# Altium project Ethernut.PrjPcb
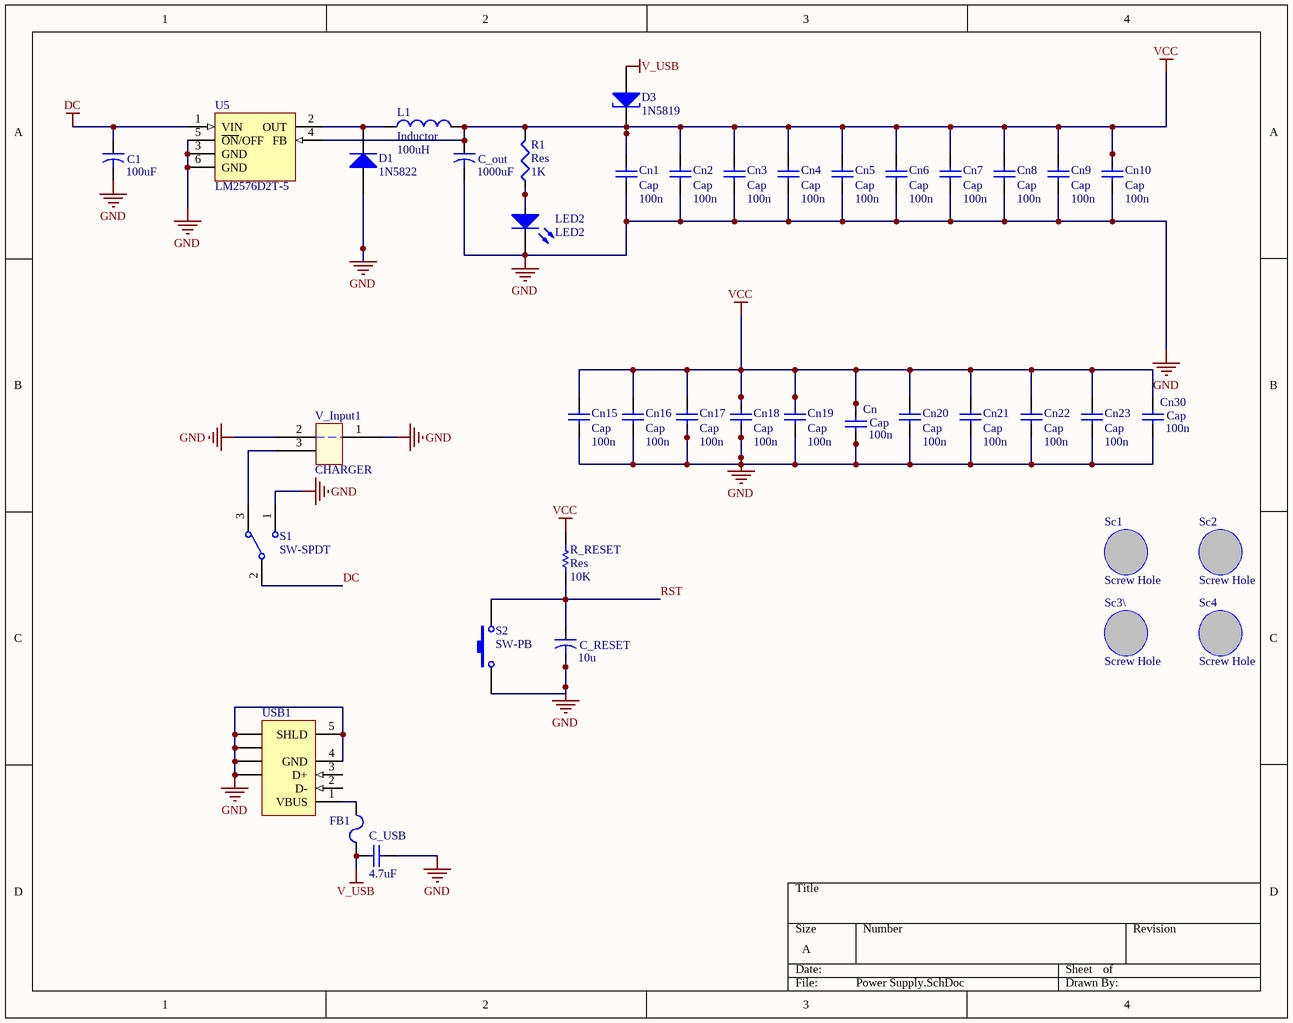
[diagram p0: Power Supply.SchDoc]
4 sheets, 98 parts. Net scope: global (net labels, ports and power ports of the same name join across sheets).
Board file: PCB1.PcbDoc
Sheets:
  Power Supply.SchDoc
  CPU.SchDoc
  Ethernet Interface.SchDoc
  SRAM & Expansion Port.SchDoc

## Sheet Power Supply.SchDoc
size A

### Parts
C1  value 100uF  [CA1.5P]  (hidden comment: Cap_El)
C_out  value 1000uF  [CA1.5P]  (hidden comment: Cap_El)
C_RESET  value 10u  [CA1.5P]  (hidden comment: Cap_El)
C_USB  value 4.7uF  [2012[0805]]  (hidden comment: Cap_UP)
Cn  Cap  value 100n  [1608[0603]]
Cn1  Cap  value 100n  [1608[0603]]
Cn2  Cap  value 100n  [1608[0603]]
Cn3  Cap  value 100n  [1608[0603]]
Cn4  Cap  value 100n  [1608[0603]]
Cn5  Cap  value 100n  [1608[0603]]
Cn6  Cap  value 100n  [1608[0603]]
Cn7  Cap  value 100n  [1608[0603]]
Cn8  Cap  value 100n  [1608[0603]]
Cn9  Cap  value 100n  [1608[0603]]
Cn10  Cap  value 100n  [1608[0603]]
Cn15  Cap  value 100n  [1608[0603]]
Cn16  Cap  value 100n  [1608[0603]]
Cn17  Cap  value 100n  [1608[0603]]
Cn18  Cap  value 100n  [1608[0603]]
Cn19  Cap  value 100n  [1608[0603]]
Cn20  Cap  value 100n  [1608[0603]]
Cn21  Cap  value 100n  [1608[0603]]
Cn22  Cap  value 100n  [1608[0603]]
Cn23  Cap  value 100n  [1608[0603]]
Cn30  Cap  value 100n  [1608[0603]]
D1  1N5822  [US1M]
D3  1N5819  [us1m]
FB1  (no value)  [2012[0805]]
L1  Inductor  value 100uH  [AXIAL-0.3]
LED2  LED2  [3518]
R1  Res  value 1K  [1608[0603]]
R_RESET  Res  value 10K  [1608[0603]]
S1  SW-SPDT  [SW-SPDT]
S2  SW-PB  [SPST-2]
Sc1  Screw Hole  [Screw Holw 3-6 mm]
Sc2  Screw Hole  [Screw Holw 3-6 mm]
Sc3\  Screw Hole  [Screw Holw 3-6 mm]
Sc4  Screw Hole  [Screw Holw 3-6 mm]
U5  LM2576D2T-5  [936A-02]
USB1  (no value)  [USB_Mini]
V_Input1  CHARGER  [CHARGER]

### Nets
DC: C1.1 S1.2 U5.1(VIN)
GND: C1.2 C_out.2 C_RESET.2 C_USB.2 Cn.2 Cn1.1 Cn2.1 Cn3.1 Cn4.1 Cn5.1 Cn6.1 Cn7.1 Cn8.1 Cn9.1 Cn10.1 Cn15.1 Cn16.1 Cn17.1 Cn18.1 Cn19.1 Cn20.1 Cn21.1 Cn22.1 Cn23.1 Cn30.2 D1.1(A) LED2.2(K) S1.1 S2.1 U5.3(GND) U5.5(~{ON}/OFF) U5.6(GND) USB1.4(GND) USB1.5(SHLD) USB1.6(SHLD) USB1.7(SHLD) USB1.8(SHLD) USB1.9(SHLD) V_Input1.1 V_Input1.2  [project net P8]
V_USB: C_USB.1 D3.2(A) FB1.2
VCC: C_out.1 Cn.1 Cn1.2 Cn2.2 Cn3.2 Cn4.2 Cn5.2 Cn6.2 Cn7.2 Cn8.2 Cn9.2 Cn10.2 Cn15.2 Cn16.2 Cn17.2 Cn18.2 Cn19.2 Cn20.2 Cn21.2 Cn22.2 Cn23.2 Cn30.1 D3.1(K) L1.2 R1.2 R_RESET.1 U5.4(FB)
RST: C_RESET.1 R_RESET.2 S2.2
NetD1_2: D1.2(K) L1.1 U5.2(OUT)
NetFB1_1: FB1.1 USB1.1(VBUS)
NetLED2_1: LED2.1(A) R1.1
NetS1_3: S1.3 V_Input1.3

Not connected (* = marked no-connect by the designer): USB1 2(D-) 3(D+)

### Library data of the parts
C1 C_out C_RESET = Cap_El: Capacitor; Published: 23-Sep-2002; PackageReference: CAPR5-4X5; Publisher: Altium Limited
C_USB Cn Cn30 = Cap_UP: Capacitor; Published: 8-Jun-2000; LatestRevisionDate: 17-Jul-2002; LatestRevisionNote: Re-released for DXP Platform.; PackageReference: RAD-0.3; Publisher: Altium Limited
Cn1-Cn10 Cn15-Cn23 = Cap: Capacitor; Published: 8-Jun-2000; LatestRevisionDate: 17-Jul-2002; LatestRevisionNote: Re-released for DXP Platform.; PackageReference: RAD-0.3; Publisher: Altium Limited; PackageDescription: Radial Cap, Thru-Hole; 2 Leads; 0.3 in Pin Spacing
D1 = Diode: 1 Amp General Purpose Rectifier; Revision 1: 11-Jul-2000: SIM Model Added.; Revision 2: 17-Jul-2002: Re-released for DXP Platform.; Package Information: Latest Revision: Aug-1999; Code - JEDEC: DO-204-AL; Published: 8-Jun-2000; Datasheet: Latest Revision: 1998; Package Reference: DO-41; Publisher: Altium Limited
D3 = Diode_ShotKey: 1 Amp General Purpose Rectifier; Revision 1: 11-Jul-2000: SIM Model Added.; Revision 2: 17-Jul-2002: Re-released for DXP Platform.; Package Information: Latest Revision: Aug-1999; Code - JEDEC: DO-204-AL; Published: 8-Jun-2000; Datasheet: Latest Revision: 1998; Package Reference: DO-41; Publisher: Altium Limited
FB1 = Ferrite Beed: Code_IEC: 1005; Published: 8-Jun-2000; LatestRevisionDate: 17-Jul-2002; LatestRevisionNote: Re-released for DXP Platform.; PackageReference: 0402-A; Publisher: Altium Limited; Code_JEITA: 0402
L1 = Inductor: Code_IEC: 1005; Published: 8-Jun-2000; LatestRevisionDate: 29-May-2009; LatestRevisionNote: IPC-7351 Footprint Added.; PackageReference: 0402-A; Publisher: Altium Limited; PackageDescription: Chip Inductor; Code_JEITA: 0402
LED2 = LED2: Typical RED, GREEN, YELLOW, AMBER GaAs LED; Published: 8-Jun-2000; LatestRevisionDate: 17-Jul-2002; LatestRevisionNote: Re-released for DXP Platform.; PackageVersion: Feb-2002; PackageReference: 3.2X1.6X1.1; Publisher: Altium Limited; PackageDescription: SM LED; 2 Flat Leads
R1 = Res3: Resistor; Published: 8-Jun-2000; LatestRevisionDate: 29-May-2009; LatestRevisionNote: IPC-7351 Footprint Added.; PackageReference: J1-0603; Publisher: Altium Limited; PackageDescription: Chip Resistor
R_RESET = Res: Semiconductor Resistor; Published: 8-Jun-2000; LatestRevisionDate: 17-Jul-2002; LatestRevisionNote: Re-released for DXP Platform.; PackageReference: AXIAL-0.5; Publisher: Altium Limited
S1 = SW-SPDT: SPDT Subminiature Toggle Switch, Right Angle Mounting, Vertical Actuation; Published: 24-Mar-1999; LatestRevisionDate: 17-Dec-2003; LatestRevisionNote: Schematic revised, PCB Footprint replaced.; DatasheetVersion: 05-Dec-2000; PackageReference: TL36WW15050; Publisher: Altium Limited; PackageDescription: Switch; 4 Leads; ComponentLink1Description: Manufacturer Link; ComponentLink1URL: http://www.apem.com
S2 = SW-PB: Switch; Published: 24-Mar-1999; LatestRevisionDate: 17-Jul-2002; LatestRevisionNote: Re-released for DXP Platform.; PackageReference: SPST-2; Publisher: Altium Limited; PackageDescription: Switch; 2 Leads
U5 = LM2576D2T-5: Easy Switcher 3.0A Step-Down Voltage Regulator; Note: Pin 3 is electrically connected to Pin 6;Pin 6 is heatsink; Published: 15-Apr-2002; DatasheetVersion: Jul-1999; PackageVersion: Jul-1999; PackageReference: 936A-02; Publisher: Altium Limited; PackageDescription: D2-PAK; 5 Leads; Body 14.7 (inc. leads) x 10.2 mm (LxW max); ComponentLink1Description: Manufacturer Link; ComponentLink1URL: http://www.onsemi.com/site/products/taxonomy/0,4438,503,00.html; ComponentLink2Description: Datasheet; ComponentLink2URL: http://www.onsemi.com/pub/Collateral/LM2576-D.PDF
USB1 = 440479-1: USB 2.0, Right Angle, SMT, AB Type, Receptacle, 5 Position, Black; ContactMaterial: Phosphor Bronze; ContactPlating: Gold (30) over Nickel; PCB_Layout: Complies with manufacturer's recommendation.; DrillSize: Corresponds to nominal value.; PanelGround: Without; Published: 15-Jul-2004; DatasheetDocument: 28-Jan-2003; PackageDocument: 28-Jan-2003; PackageReference: 440479; Publisher: Altium Limited; HousingMaterial: Thermoplastic; ComponentLink1Description: Manufacturer Link; ComponentLink1URL: http://www.tycoelectronics.com/; ComponentLink2Description: Packaging Specification; ComponentLink2URL: http://ecommas.tycoelectronics.com/commerce/DocumentDelivery/DDEController?Action=showdoc&DocId=Customer+Drawing%7F440479%7FD%7Fpdf%7FEnglish%7FC_440479_D.pdf

## Sheet CPU.SchDoc
size A
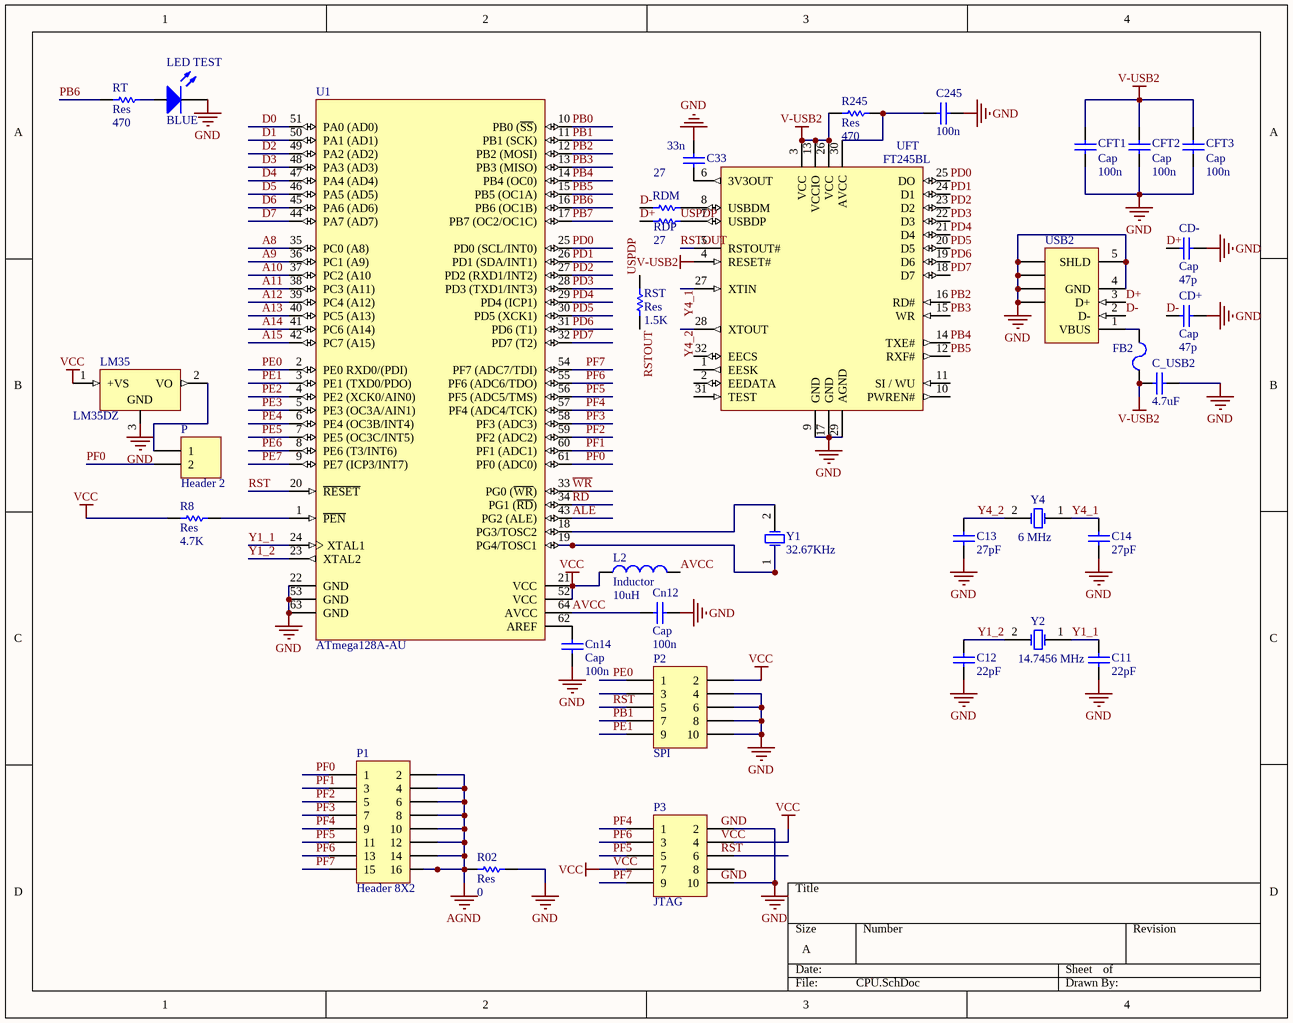
[diagram p1: CPU.SchDoc]

### Parts
C11  value 22pF  [1608[0603]]  (hidden comment: Cap_UP)
C12  value 22pF  [1608[0603]]  (hidden comment: Cap_UP)
C13  value 27pF  [1608[0603]]  (hidden comment: Cap_UP)
C14  value 27pF  [1608[0603]]  (hidden comment: Cap_UP)
C33  value 33n  [1608[0603]]  (hidden comment: Cap_UP)
C245  value 100n  [1608[0603]]  (hidden comment: Cap_UP)
C_USB2  value 4.7uF  [2012[0805]]  (hidden comment: Cap_UP)
CD+  Cap  value 47p  [1608[0603]]
CD-  Cap  value 47p  [1608[0603]]
CFT1  Cap  value 100n  [1608[0603]]
CFT2  Cap  value 100n  [1608[0603]]
CFT3  Cap  value 100n  [1608[0603]]
Cn12  Cap  value 100n  [1608[0603]]
Cn14  Cap  value 100n  [1608[0603]]
FB2  (no value)  [2012[0805]]
L2  Inductor  value 10uH  [2012[0805]]
LED_TEST  BLUE  [3518]
LM35  LM35DZ  [Z03A]
P  Header 2  [HDR1X2]
P1  Header 8X2  [HDR2X8]
P2  SPI  [HDR2X5]
P3  JTAG  [HDR2X5]
R02  Res  value 0  [1608[0603]]
R8  Res  value 4.7K  [1608[0603]]
R245  Res  value 470  [1608[0603]]
RDM  value 27  [1608[0603]]  (hidden comment: Res)
RDP  value 27  [1608[0603]]  (hidden comment: es)
RST  Res  value 1.5K  [1608[0603]]
RT  Res  value 470  [1608[0603]]
U1  ATmega128A-AU  [64A_N]
UFT  FT245BL  [LQFP-32_N]
USB2  (no value)  [USB_Mini]
Y1  32.67KHz  [Xtal-smd]
Y2  14.7456 MHz  [Xtal-smd]
Y4  6 MHz  [Xtal-smd]

### Nets
AGND: P1.2 P1.4 P1.6 P1.8 P1.10 P1.12 P1.14 P1.16 R02.2
GND: C11.2 C12.2 C13.2 C14.2 C33.2 C245.2 C_USB2.2 CD+.1 CD-.1 CFT1.1 CFT2.1 CFT3.1 Cn12.1 Cn14.2 LED_TEST.2(K) P2.4 P2.6 P2.8 P2.10 P3.2 P3.10 R02.1 U1.22(GND) U1.53(GND) U1.63(GND) UFT.9(GND) UFT.17(GND) UFT.29(AGND) USB2.4(GND) USB2.5(SHLD) USB2.6(SHLD) USB2.7(SHLD) USB2.8(SHLD) USB2.9(SHLD)  [project net P8]
V-USB2: C_USB2.1 CFT1.2 CFT2.2 CFT3.2 FB2.2 R245.1 UFT.3(VCC) UFT.4(RESET#) UFT.13(VCCIO) UFT.26(VCC)
VCC: L2.1 LM35.1(+VS) P2.2 P3.4 P3.7 R8.1 U1.21(VCC) U1.52(VCC)
A8: U1.35(PC0_(A8))
A9: U1.36(PC1_(A9))
A10: U1.37(PC2_(A10)
A11: U1.38(PC3_(A11))
A12: U1.39(PC4_(A12))
A13: U1.40(PC5_(A13))
A14: U1.41(PC6_(A14))
A15: U1.42(PC7_(A15))
ALE: U1.43(PG2_(ALE))
AVCC: Cn12.2 L2.2 U1.64(AVCC)
D0: U1.51(PA0_(AD0))
D1: U1.50(PA1_(AD1))
D2: U1.49(PA2_(AD2))
D3: U1.48(PA3_(AD3))
D4: U1.47(PA4_(AD4))
D5: U1.46(PA5_(AD5))
D6: U1.45(PA6_(AD6))
D7: U1.44(PA7_(AD7))
D+: CD-.2 RDP.1 USB2.3(D+)
D-: CD+.2 RDM.1 USB2.2(D-)
PB0: U1.10(PB0_(~{SS}))
PB1: P2.7 U1.11(PB1_(SCK))
PB2: U1.12(PB2_(MOSI)) UFT.16(RD#)
PB3: U1.13(PB3_(MISO)) UFT.15(WR)
PB4: U1.14(PB4_(OC0)) UFT.14(TXE#)
PB5: U1.15(PB5_(OC1A)) UFT.12(RXF#)
PB6: RT.2 U1.16(PB6_(OC1B))
PB7: U1.17(PB7_(OC2/OC1C))
PD0: U1.25(PD0_(SCL/INT0)) UFT.25(DO)
PD1: U1.26(PD1_(SDA/INT1)) UFT.24(D1)
PD2: U1.27(PD2_(RXD1/INT2)) UFT.23(D2)
PD3: U1.28(PD3_(TXD1/INT3)) UFT.22(D3)
PD4: U1.29(PD4_(ICP1)) UFT.21(D4)
PD5: U1.30(PD5_(XCK1)) UFT.20(D5)
PD6: U1.31(PD6_(T1)) UFT.19(D6)
PD7: U1.32(PD7_(T2)) UFT.18(D7)
PE0: P2.1 U1.2(PE0_RXD0/(PDI))
PE1: P2.9 U1.3(PE1_(TXD0/PDO))
PE2: U1.4(PE2_(XCK0/AIN0))
PE3: U1.5(PE3_(OC3A/AIN1))
PE4: U1.6(PE4_(OC3B/INT4))
PE5: U1.7(PE5_(OC3C/INT5))
PE6: U1.8(PE6_(T3/INT6))
PE7: U1.9(PE7_(ICP3/INT7))
PF0: P.2 P1.1 U1.61(PF0_(ADC0))
PF1: P1.3 U1.60(PF1_(ADC1))
PF2: P1.5 U1.59(PF2_(ADC2))
PF3: P1.7 U1.58(PF3_(ADC3))
PF4: P1.9 P3.1 U1.57(PF4_(ADC4/TCK))
PF5: P1.11 P3.5 U1.56(PF5_(ADC5/TMS))
PF6: P1.13 P3.3 U1.55(PF6_(ADC6/TDO))
PF7: P1.15 P3.9 U1.54(PF7_(ADC7/TDI))
~{RD}: U1.34(PG1_(~{RD}))
RST: P2.5 U1.20(~{RESET})
RSTOUT: RST.1 UFT.5(RSTOUT#)
USPDP: RST.2
~{WR}: U1.33(PG0_(~{WR}))
Y1_1: C11.1 U1.24(XTAL1) Y2.1(OSC1)
Y1_2: C12.1 U1.23(XTAL2) Y2.2(OSC2)
Y4_1: C14.1 UFT.27(XTIN) Y4.1(OSC1)
Y4_2: C13.1 UFT.28(XTOUT) Y4.2(OSC2)
NetC33_1: C33.1 UFT.6(3V3OUT)
NetC245_1: C245.1 R245.2 UFT.30(AVCC)
NetCn14_1: Cn14.1 U1.62(AREF)
NetFB2_1: FB2.1 USB2.1(VBUS)
NetLED_TEST_1: LED_TEST.1(A) RT.1
NetLM35_2: LM35.2(VO) P.1
NetR8_2: R8.2 U1.1(~{PEN})
NetRDM_2: RDM.2 UFT.8(USBDM)
NetRDP_2: RDP.2 UFT.7(USBDP)
NetU1_18: U1.18(PG3/TOSC2) Y1.2(OSC2)
NetU1_19: U1.19(PG4/TOSC1) Y1.1(OSC1)

Not connected (* = marked no-connect by the designer): LM35 3(GND); P2 3; P3 6 8; UFT 1(EESK) 2(EEDATA) 10(PWREN#) 11(SI_/_WU) 31(TEST) 32(EECS)

### Notes on the sheet
- Labels drawn without touching a wire or pin: GND, RST, USPDP, VCC

### Library data of the parts
C11-C14 C33 C245 C_USB2 = Cap_UP: Capacitor; Published: 8-Jun-2000; LatestRevisionDate: 17-Jul-2002; LatestRevisionNote: Re-released for DXP Platform.; PackageReference: RAD-0.3; Publisher: Altium Limited
CD+ CD- CFT1-CFT3 Cn12 Cn14 = Cap: Capacitor; Published: 8-Jun-2000; LatestRevisionDate: 17-Jul-2002; LatestRevisionNote: Re-released for DXP Platform.; PackageReference: RAD-0.3; Publisher: Altium Limited; PackageDescription: Radial Cap, Thru-Hole; 2 Leads; 0.3 in Pin Spacing
FB2 = Ferrite Beed: Code_IEC: 1005; Published: 8-Jun-2000; LatestRevisionDate: 17-Jul-2002; LatestRevisionNote: Re-released for DXP Platform.; PackageReference: 0402-A; Publisher: Altium Limited; Code_JEITA: 0402
L2 = Inductor: Code_IEC: 1005; Published: 8-Jun-2000; LatestRevisionDate: 29-May-2009; LatestRevisionNote: IPC-7351 Footprint Added.; PackageReference: 0402-A; Publisher: Altium Limited; PackageDescription: Chip Inductor; Code_JEITA: 0402
LED_TEST = LED3: Typical BLUE SiC LED; Published: 8-Jun-2000; LatestRevisionDate: 17-Dec-2003; LatestRevisionNote: PCB Footprint replaced.; DatasheetVersion: 16-Apr-2002; PackageVersion: 16-Apr-2002; PackageReference: 3.5X2.8X1.9; Publisher: Altium Limited; PackageDescription: SM LED; 2 C-Bend Leads; Body 3.5 x 2.8 x 1.9 mm, inc leads (LxWxH typ)
LM35 = LM35DZ: Precision Centigrade Temperature Sensor, 3-pin TO-92; Manufacturer: National Semiconductor; PackageTopMarking: NSXYTT*LM35*DZ; PowerWise: N; CompType: Temp Sensor IC; High-Reliability: Y; DatasheetVersion: Nov-2000; PackageVersion: revG, Sep-2000; PackageReference: Z03A; PackageDescription: TO-92, Molded, 3 Lead; PartNumber: LM35DZ; RoHS: N; PinCount: 3; Code_JEDEC: TO-226-AA; ComponentLink1Description: Manufacturer URL; ComponentLink1URL: http://www.national.com/; ComponentLink2Description: LM35 Datasheet; ComponentLink2URL: http://www.national.com/ds/LM/LM35.pdf; ComponentLink3Description: LM35 Web Page; ComponentLink3URL: http://www.national.com/pf/LM/LM35.html; ComponentLink4Description: Z03A Package Page; ComponentLink4URL: http://www.national.com/packaging/folders/z03a.html
P = Header 2: Header, 2-Pin; LatestRevisionDate: 17-Jul-2002; LatestRevisionNote: Re-released for DXP Platform.; Publisher: Altium Limited
P1 = Header 8X2: Header, 8-Pin, Dual row; LatestRevisionDate: 17-Jul-2002; LatestRevisionNote: Re-released for DXP Platform.; Publisher: Altium Limited
P2 P3 = Header 5X2: Header, 5-Pin, Dual row; LatestRevisionDate: 17-Jul-2002; LatestRevisionNote: Re-released for DXP Platform.; Publisher: Altium Limited
R02 R8 R245 RDM RDP RST RT = Res: Semiconductor Resistor; Published: 8-Jun-2000; LatestRevisionDate: 17-Jul-2002; LatestRevisionNote: Re-released for DXP Platform.; PackageReference: AXIAL-0.5; Publisher: Altium Limited
U1 = ATmega128A-AU: 8-bit AVR Microcontroller, 2.7-5.5V, 16MHz, 128KB Flash, 4KB EEPROM, 4KB SRAM, 64-pin TQFP, Industrial Grade (-40°C to 85°C); DatasheetVersion: revH, Feb-2011; PackageVersion: revC, Oct-2010; PackageReference: 64A; PackageDescription: 64-Pin Plastic Thin Profile Quad Flat Pack, 14 x 14 x 1.0 mm Body, 0.8 mm Pitch (TQFP); Code_JEDEC: MS-026-AEB; ComponentLink1Description: Manufacturer URL; ComponentLink1URL: http://www.atmel.com/; ComponentLink2Description: ATmega128A Datasheet; ComponentLink2URL: http://www.atmel.com/dyn/resources/prod_documents/doc8151.pdf; ComponentLink3Description: ATmega128A Summary; ComponentLink3URL: http://www.atmel.com/dyn/resources/prod_documents/8151S.pdf
UFT = FT245BL: USB/Parallel FIFO Bi-Directional Data Transfer Chip, LQFP-32, Pb-Free; Published: 6-Jun-2005; LatestRevisionDate: 13-Apr-2006; LatestRevisionNote: IPC-7351 Footprint Added.; DatasheetVersion: ver 1.7, Dec-2005; PackageVersion: 2004; PackageReference: LQFP-32; Publisher: Altium Limited; PackageDescription: 32-Pin Thin Quad Flat Pack 0.8 mm Pitch; ComponentLink1Description: Manufacturer Link; ComponentLink1URL: http://www.ftdichip.com/Products/ICs/FT245B.htm; ComponentLink2Description: Datasheet; ComponentLink2URL: http://www.ftdichip.com/Support/Documents/DataSheets/ICs/DS_FT245BL.pdf
USB2 = 440479-1: as USB1 on sheet Power Supply; Published: 15-Jul-2004; DatasheetDocument: 28-Jan-2003; PackageDocument: 28-Jan-2003; PackageReference: 440479; Publisher: Altium Limited; HousingMaterial: Thermoplastic; ComponentLink1Description: Manufacturer Link; ComponentLink1URL: http://www.tycoelectronics.com/; ComponentLink2Description: Packaging Specification; ComponentLink2URL: http://ecommas.tycoelectronics.com/commerce/DocumentDelivery/DDEController?Action=showdoc&DocId=Customer+Drawing%7F440479%7FD%7Fpdf%7FEnglish%7FC_440479_D.pdf
Y1 Y2 Y4 = XTAL: Crystal Oscillator; Published: 8-Jun-2000; LatestRevisionDate: 17-Jul-2002; LatestRevisionNote: Re-released for DXP Platform.; PackageReference: R38; Publisher: Altium Limited

## Sheet Ethernet Interface.SchDoc
size A
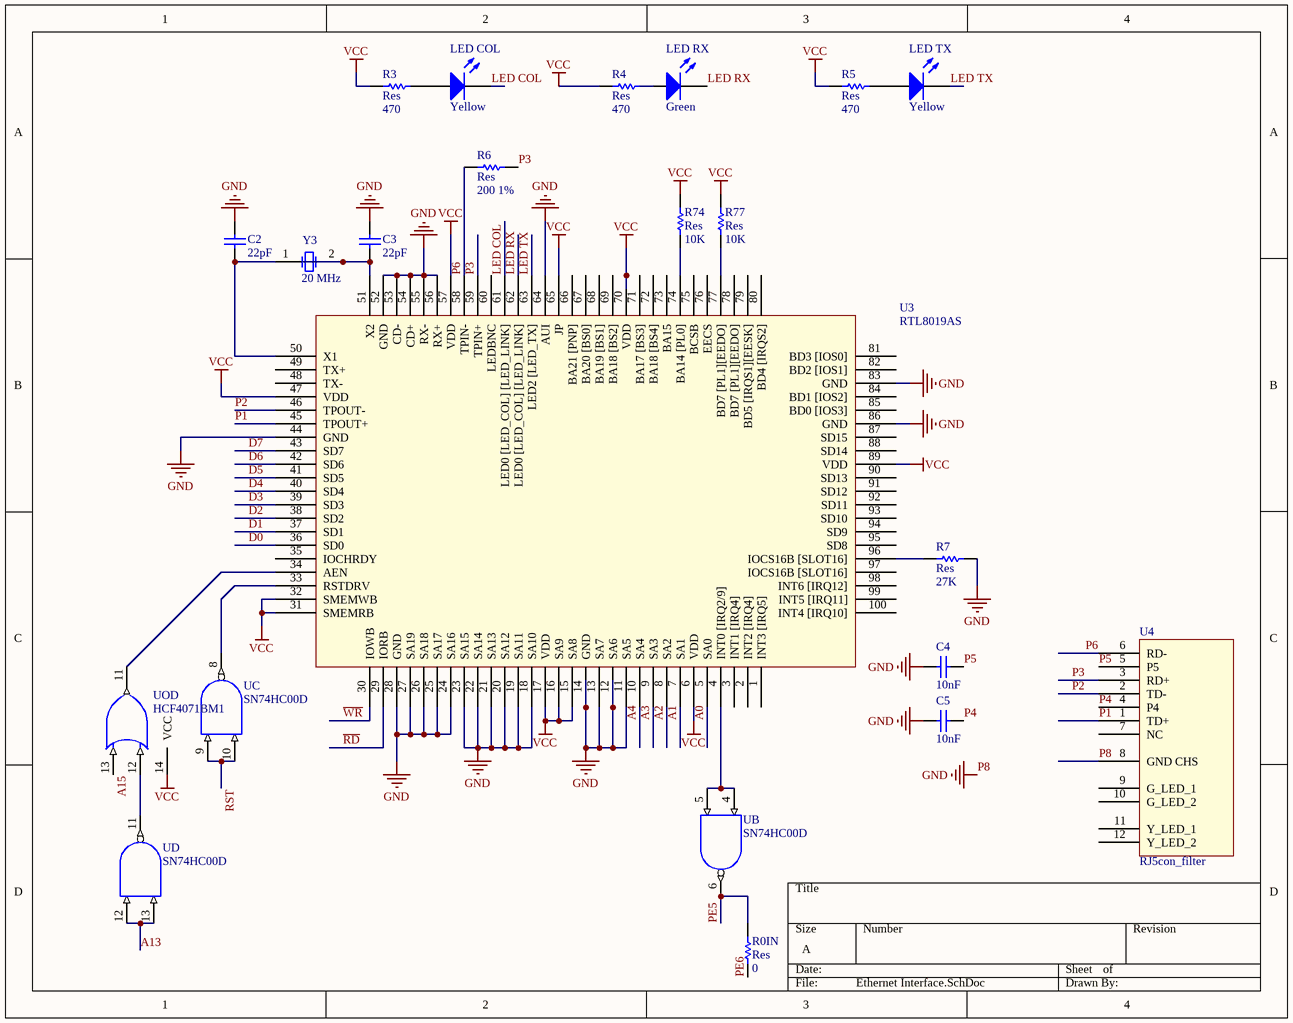
[diagram p2: Ethernet Interface.SchDoc]

### Parts
C2  value 22pF  [1608[0603]]  (hidden comment: Cap_UP)
C3  value 22pF  [1608[0603]]  (hidden comment: Cap_UP)
C4  value 10nF  [1608[0603]]  (hidden comment: Cap_UP)
C5  value 10nF  [1608[0603]]  (hidden comment: Cap_UP)
LED_COL  Yellow  [3518]
LED_RX  Green  [3518]
LED_TX  Yellow  [3518]
R0IN  Res  value 0  [1608[0603]]
R3  Res  value 470  [1608[0603]]
R4  Res  value 470  [1608[0603]]
R5  Res  value 470  [1608[0603]]
R6  Res  value 200 1%  [1608[0603]]
R7  Res  value 27K  [1608[0603]]
R74  Res  value 10K  [1608[0603]]
R77  Res  value 10K  [1608[0603]]
U  SN74HC00D  [D014_N]  (parts B,C,D of 4)
U3  RTL8019AS  [RTL8019AS]
U4  RJ5con_filter  [RJ45con_Filter]
UO  HCF4071BM1  [SO14_N]  (part D of 4)
Y3  20 MHz  [Xtal-smd]

### Nets
P8: C2.2 C3.2 C4.1 C5.1 R7.1 U.7(GND) U3.11(SA5) U3.12(SA6) U3.13(SA7) U3.14(GND) U3.18(SA10) U3.19(SA11) U3.20(SA12) U3.21(SA13) U3.22(SA14) U3.23(SA15) U3.24(SA16) U3.25(SA17) U3.26(SA18) U3.27(SA19) U3.28(GND) U3.44(GND) U3.52(GND) U3.53(CD-) U3.54(CD+) U3.55(RX-) U3.56(RX+) U3.64(AUI) U3.83(GND) U3.86(GND) U4.8(GND_CHS) UO.7(GND)  [also labelled GND]
VCC: R3.2 R4.2 R5.2 R74.1 R77.1 U.14(VCC) U3.6(VDD) U3.15(SA8) U3.16(SA9) U3.17(VDD) U3.31(SMEMRB) U3.32(SMEMWB) U3.47(VDD) U3.57(VDD) U3.65(JP) U3.70(VDD) U3.89(VDD) UO.14(VCC)
A0: U3.5(SA0)
A1: U3.7(SA1)
A2: U3.8(SA2)
A3: U3.9(SA3)
A4: U3.10(SA4)
A13: U.12(A) U.13(B)
A15: UO.13(G)
D0: U3.36(SD0)
D1: U3.37(SD1)
D2: U3.38(SD2)
D3: U3.39(SD3)
D4: U3.40(SD4)
D5: U3.41(SD5)
D6: U3.42(SD6)
D7: U3.43(SD7)
LED COL: LED_COL.2(K) U3.61(LED0_[LED_COL]_[LED_LINK])
LED RX: LED_RX.2(K) U3.62(LED0_[LED_COL]_[LED_LINK])
LED TX: LED_TX.2(K) U3.63(LED2_[LED_TX])
P1: U3.45(TPOUT+) U4.1(TD+)
P2: U3.46(TPOUT-) U4.2(TD-)
P3: R6.2 U3.59(TPIN+) U4.3(RD+)
P4: C5.2 U4.4(P4)
P5: C4.2 U4.5(P5)
P6: R6.1 U3.58(TPIN-) U4.6(RD-)
PE5: R0IN.1 U.6(Y)
PE6: R0IN.2
~{RD}: U3.29(IORB)
RST: U.9(A) U.10(B)
~{WR}: U3.30(IOWB)
NetC2_1: C2.1 U3.50(X1) Y3.1(OSC1)
NetC3_1: C3.1 U3.51(X2) Y3.2(OSC2)
NetLED_COL_1: LED_COL.1(A) R3.1
NetLED_RX_1: LED_RX.1(A) R4.1
NetLED_TX_1: LED_TX.1(A) R5.1
NetR7_2: R7.2 U3.96(IOCS16B_[SLOT16])
NetR74_2: R74.2 U3.74(BA14_[PL0])
NetR77_2: R77.2 U3.77(BD7_[PL1][EEDO])
NetU3_34: U3.34(AEN) UO.11(M)
NetU_4: U.4(A) U.5(B) U3.4(INT0_[IRQ2/9])
NetU_8: U.8(Y) U3.33(RSTDRV)
NetU_11: U.11(Y) UO.12(H)

Not connected (* = marked no-connect by the designer): U3 1(INT3_[IRQ5]) 2(INT2_[IRQ4]) 3(INT1_[IRQ4]) 35(IOCHRDY) 48(TX-) 49(TX+) 60(LEDBNC) 66(BA21_[PNP]) 67(BA20_[BS0]) 68(BA19_[BS1]) 69(BA18_[BS2]) 71(BA17_[BS3]) 72(BA18_[BS4]) 73(BA15) 75(BCSB) 76(EECS) 78(BD7_[PL1][EEDO]) 79(BD5_[IRQS1][EESK]) 80(BD4_[IRQS2]) 81(BD3_[IOS0]) 82(BD2_[IOS1]) 84(BD1_[IOS2]) 85(BD0_[IOS3]) 87(SD15) 88(SD14) 90(SD13) 91(SD12) 92(SD11) 93(SD10) 94(SD9) 95(SD8) 97(IOCS16B_[SLOT16]) 98(INT6_[IRQ12]) 99(INT5_[IRQ11]) 100(INT4_[IRQ10]); U4 7(NC) 9(G_LED_1) 10(G_LED_2) 11(Y_LED_1) 12(Y_LED_2)

### Library data of the parts
C2-C5 = Cap_UP: Capacitor; Published: 8-Jun-2000; LatestRevisionDate: 17-Jul-2002; LatestRevisionNote: Re-released for DXP Platform.; PackageReference: RAD-0.3; Publisher: Altium Limited
LED_COL LED_RX LED_TX = LED3: Typical BLUE SiC LED; Published: 8-Jun-2000; LatestRevisionDate: 17-Dec-2003; LatestRevisionNote: PCB Footprint replaced.; DatasheetVersion: 16-Apr-2002; PackageVersion: 16-Apr-2002; PackageReference: 3.5X2.8X1.9; Publisher: Altium Limited; PackageDescription: SM LED; 2 C-Bend Leads; Body 3.5 x 2.8 x 1.9 mm, inc leads (LxWxH typ)
R0IN R3-R7 R74 R77 = Res: Semiconductor Resistor; Published: 8-Jun-2000; LatestRevisionDate: 17-Jul-2002; LatestRevisionNote: Re-released for DXP Platform.; PackageReference: AXIAL-0.5; Publisher: Altium Limited
U = SN74HC00D: Quadruple 2-Input Positive-NAND Gate; Published: 8-Jun-2000; LatestRevisionDate: 13-Apr-2006; LatestRevisionNote: IPC-7351 Footprint Added.; DatasheetVersion: May-1997; PackageVersion: Jan-1998; PackageReference: D014; Publisher: Altium Limited; PackageDescription: 14-Pin Small Outline Integrated Circuit 1.27 mm Pitch; Code_IPC: SOIC127P600-14; ComponentLink1Description: Manufacturer Link; ComponentLink1URL: http://www.ti.com/; ComponentLink2Description: Datasheet; ComponentLink2URL: http://www-s.ti.com/sc/ds/sn74hc00.pdf
U3 = RTL8019_as
U4 = HR911105A
UO = HCF4071BM1: Quad 2-Input OR Gate; Published: 8-Jun-2000; LatestRevisionDate: 13-Apr-2006; LatestRevisionNote: IPC-7351 Footprint Added.; DatasheetVersion: Jun-1989; PackageVersion: Sep-1998; PackageReference: SO14; Publisher: Altium Limited; PackageDescription: 14-Pin Small Outline Integrated Circuit 1.27 mm Pitch; Code_IPC: SOIC127P600-14; ComponentLink1Description: Manufacturer Link; ComponentLink1URL: http://www.st.com/; ComponentLink2Description: Datasheet; ComponentLink2URL: http://www.st.com/stonline/products/literature/ds/2062/hcf4071.pdf
Y3 = XTAL: Crystal Oscillator; Published: 8-Jun-2000; LatestRevisionDate: 17-Jul-2002; LatestRevisionNote: Re-released for DXP Platform.; PackageReference: R38; Publisher: Altium Limited

## Sheet SRAM & Expansion Port.SchDoc
size A
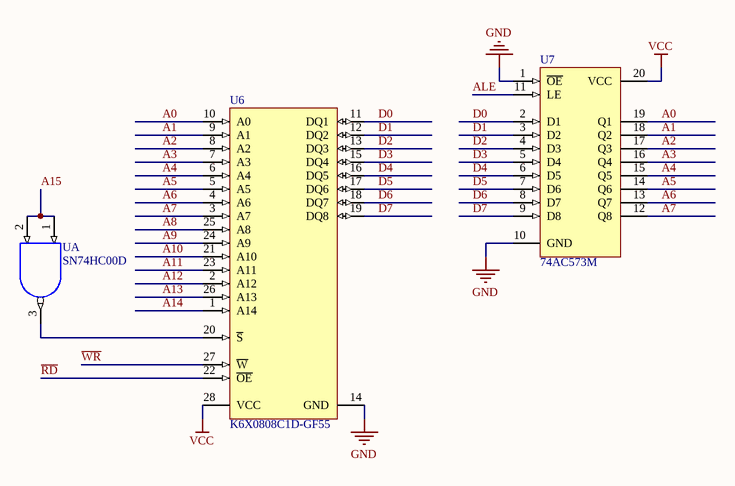
[diagram p3: SRAM & Expansion Port.SchDoc]

### Parts
U  SN74HC00D  [D014_N]  (part A of 4)
U6  K6X0808C1D-GF55  [PRSP0028DB-B_N]
U7  74AC573M  [SO20_N]

### Nets
GND: U.7(GND) U6.14(GND) U7.1(~{OE}) U7.10(GND)  [project net P8]
VCC: U.14(VCC) U6.28(VCC) U7.20(VCC)
A0: U6.10(A0) U7.19(Q1)
A1: U6.9(A1) U7.18(Q2)
A2: U6.8(A2) U7.17(Q3)
A3: U6.7(A3) U7.16(Q4)
A4: U6.6(A4) U7.15(Q5)
A5: U6.5(A5) U7.14(Q6)
A6: U6.4(A6) U7.13(Q7)
A7: U6.3(A7) U7.12(Q8)
A8: U6.25(A8)
A9: U6.24(A9)
A10: U6.21(A10)
A11: U6.23(A11)
A12: U6.2(A12)
A13: U6.26(A13)
A14: U6.1(A14)
A15: U.1(A) U.2(B)
ALE: U7.11(LE)
D0: U6.11(DQ1) U7.2(D1)
D1: U6.12(DQ2) U7.3(D2)
D2: U6.13(DQ3) U7.4(D3)
D3: U6.15(DQ4) U7.5(D4)
D4: U6.16(DQ5) U7.6(D5)
D5: U6.17(DQ6) U7.7(D6)
D6: U6.18(DQ7) U7.8(D7)
D7: U6.19(DQ8) U7.9(D8)
~{RD}: U6.22(~{OE})
~{WR}: U6.27(~{W})
NetU_3: U.3(Y) U6.20(~{S})

### Library data of the parts
U = SN74HC00D: Quadruple 2-Input Positive-NAND Gate; Published: 8-Jun-2000; LatestRevisionDate: 13-Apr-2006; LatestRevisionNote: IPC-7351 Footprint Added.; DatasheetVersion: May-1997; PackageVersion: Jan-1998; PackageReference: D014; Publisher: Altium Limited; PackageDescription: 14-Pin Small Outline Integrated Circuit 1.27 mm Pitch; Code_IPC: SOIC127P600-14; ComponentLink1Description: Manufacturer Link; ComponentLink1URL: http://www.ti.com/; ComponentLink2Description: Datasheet; ComponentLink2URL: http://www-s.ti.com/sc/ds/sn74hc00.pdf
U6 = M5M5256DFP-55LL: 262144-bit (32768-word x 8-bit) CMOS SRAM; Published: 3-Mar-2010; DatasheetVersion: Rev.2.1, Feb-2004; PackageVersion: Sep-2005; PackageReference: PRSP0028DB-B; Publisher: Altium Limited; PackageDescription: 28-Pin Small Outline Integrated Circuit 1.27 mm Pitch; Code_JEITA: P-SOP28-8.4x17.5-1.27; ComponentLink1Description: Manufacturer Link; ComponentLink1URL: http://sg.renesas.com/products/memory/memory_category_landing.jsp; ComponentLink2Description: Datasheet; ComponentLink2URL: http://documentation.renesas.com/eng/products/memory/rej03c0055_m5m5256dfp.pdf; ComponentLink3Description: Packaging Specification; ComponentLink3URL: http://sg.renesas.com/media/products/common_info/package/pdf/ic/code/prsp0028db_b.pdf
U7 = 74AC573M: Octal D-Type Latch with 3-State Output Non-Inverting; Published: 8-Jun-2000; LatestRevisionDate: 13-Apr-2006; LatestRevisionNote: IPC-7351 Footprint Added.; DatasheetVersion: Apr-1997; PackageVersion: Jul-2001; PackageReference: SO20; Publisher: Altium Limited; PackageDescription: 20-Pin Plastic Small Outline Integrated Circuit 1.27 mm Pitch; Code_JEDEC: MS-013-AC; Code_IPC: SOIC127P1030-20; ComponentLink1Description: Manufacturer Link; ComponentLink1URL: http://www.st.com/; ComponentLink2Description: Datasheet; ComponentLink2URL: http://www.st.com/stonline/products/literature/ds/4702/74ac573.pdf

## Nets that join several sheets
P8: Power Supply (40 pins), CPU (34 pins), Ethernet Interface (32 pins), SRAM & Expansion Port (U.7 U6.14 U7.1 U7.10)
VCC: Power Supply (27 pins), CPU (8 pins), Ethernet Interface (18 pins), SRAM & Expansion Port (U.14 U6.28 U7.20)
A0: Ethernet Interface (U3.5), SRAM & Expansion Port (U6.10 U7.19)
A1: Ethernet Interface (U3.7), SRAM & Expansion Port (U6.9 U7.18)
A2: Ethernet Interface (U3.8), SRAM & Expansion Port (U6.8 U7.17)
A3: Ethernet Interface (U3.9), SRAM & Expansion Port (U6.7 U7.16)
A4: Ethernet Interface (U3.10), SRAM & Expansion Port (U6.6 U7.15)
A8: CPU (U1.35), SRAM & Expansion Port (U6.25)
A9: CPU (U1.36), SRAM & Expansion Port (U6.24)
A10: CPU (U1.37), SRAM & Expansion Port (U6.21)
A11: CPU (U1.38), SRAM & Expansion Port (U6.23)
A12: CPU (U1.39), SRAM & Expansion Port (U6.2)
A13: CPU (U1.40), Ethernet Interface (U.12 U.13), SRAM & Expansion Port (U6.26)
A14: CPU (U1.41), SRAM & Expansion Port (U6.1)
A15: CPU (U1.42), Ethernet Interface (UO.13), SRAM & Expansion Port (U.1 U.2)
ALE: CPU (U1.43), SRAM & Expansion Port (U7.11)
D0: CPU (U1.51), Ethernet Interface (U3.36), SRAM & Expansion Port (U6.11 U7.2)
D1: CPU (U1.50), Ethernet Interface (U3.37), SRAM & Expansion Port (U6.12 U7.3)
D2: CPU (U1.49), Ethernet Interface (U3.38), SRAM & Expansion Port (U6.13 U7.4)
D3: CPU (U1.48), Ethernet Interface (U3.39), SRAM & Expansion Port (U6.15 U7.5)
D4: CPU (U1.47), Ethernet Interface (U3.40), SRAM & Expansion Port (U6.16 U7.6)
D5: CPU (U1.46), Ethernet Interface (U3.41), SRAM & Expansion Port (U6.17 U7.7)
D6: CPU (U1.45), Ethernet Interface (U3.42), SRAM & Expansion Port (U6.18 U7.8)
D7: CPU (U1.44), Ethernet Interface (U3.43), SRAM & Expansion Port (U6.19 U7.9)
PE5: CPU (U1.7), Ethernet Interface (R0IN.1 U.6)
PE6: CPU (U1.8), Ethernet Interface (R0IN.2)
~{RD}: CPU (U1.34), Ethernet Interface (U3.29), SRAM & Expansion Port (U6.22)
RST: Power Supply (C_RESET.1 R_RESET.2 S2.2), CPU (P2.5 U1.20), Ethernet Interface (U.9 U.10)
~{WR}: CPU (U1.33), Ethernet Interface (U3.30), SRAM & Expansion Port (U6.27)